# EAGLE design main (EAGLE 6.6.0)
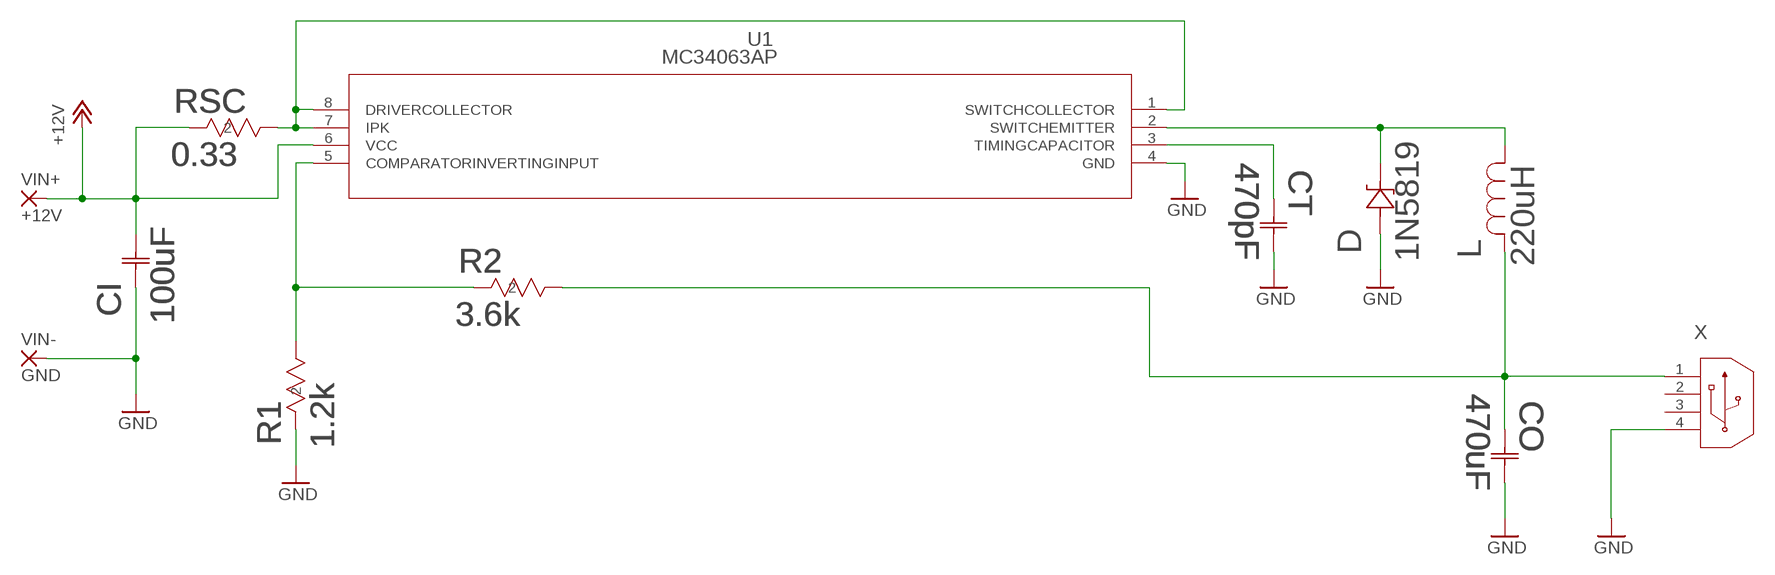
[diagram p0: schematic, sheet 1]

## Parts
CI  100uF  UVR1V101MED1TD  [U1-I_NCH]
CO  470uF  UVR1V101MED1TD  [U1-I_NCH]
CT  470pF  FA28C0G1H471JNU06  [CAP_FA28_TDK]
D  1N5819  [DO-41_STM]
L  220uH  6000-221K-RC  [IND_6000]
R1  1.2k  MRS16000C1201FCT00  [RES_MRS16_VIS]
R2  3.6k  RNMF14FTC3K60  [STA_RNMF14_STP]
RSC  0.33  PF1262-0R33F1  [PF1262-0R33F1]
U1  MC34063AP  [P8]
VIN+  +12V  2,54/1,1  [2,54/1,1]
VIN-  GND  2,54/1,1  [2,54/1,1]
X  6364372-2  [CONN_6364372-2_TEC]

## Nets
+12V: CI.2 RSC.2 U1.6(VCC) VIN+.1(P)
GND: CI.1 CO.2 CT.2 D.2 R1.2 U1.4(GND) VIN-.1(P) X.4
N$1: CT.1 U1.3(TIMINGCAPACITOR)
N$2: D.1 L.1 U1.2(SWITCHEMITTER)
N$3: CO.1 L.2 R2.1 X.1
N$4: RSC.1 U1.1(SWITCHCOLLECTOR) U1.7(IPK) U1.8(DRIVERCOLLECTOR)
N$5: R1.1 R2.2 U1.5(COMPARATORINVERTINGINPUT)
Unconnected: X.2 X.3

## Library data of the parts
CI CO = USB_Car_Charger_Parts:UVR1V101MED1TD; BUILT_BY: EMA_UL_Team; MANUFACTURER_PART_NUMBER: UVR1V101MED1TD; SOURCELIBRARY: Nichicon_2014-12-31; VENDOR: Nichicon
CT = USB_Car_Charger_Parts:FA28C0G1H471JNU06; BUILT_BY: EMA_Matt; COPYRIGHT: Copyright (C) 2018 Accelerated Designs. All rights reserved; MANUFACTURER_PART_NUMBER: FA28C0G1H471JNU06; SOURCELIBRARY: TDK_2019-10-09; VENDOR: TDK
D = USB_Car_Charger_Parts:1N5819; BUILT_BY: EMA_UL_Team; MANUFACTURER_PART_NUMBER: 1N5819; SOURCELIBRARY: StMicro_2011-06-07; VENDOR: STMicroelectronics
L = USB_Car_Charger_Parts:6000-221K-RC; BUILT_BY: EMA_UL_Team; MANUFACTURER_PART_NUMBER: 6000-221K-RC; SOURCELIBRARY: Bourns_2010-01-01_IND_6000; VENDOR: Bourns Electronics
R1 = USB_Car_Charger_Parts:MRS16000C1201FCT00; BUILT_BY: EMA_UL_Team; MANUFACTURER_PART_NUMBER: MRS16000C1201FCT00; SOURCELIBRARY: Vishay_2020-02-10; VENDOR: Vishay
R2 = USB_Car_Charger_Parts:RNMF14FTC3K60; BUILT_BY: EMA_UL_Team; MANUFACTURER_PART_NUMBER: RNMF14FTC3K60; SOURCELIBRARY: Stackpole_2014-12-31; VENDOR: Stackpole International
RSC = USB_Car_Charger_Parts:PF1262-0R33F1
U1 = USB_Car_Charger_Parts:MC34063AP; DATASHEET_URL: http://www.ti.com/lit/gpn/MC34063A; DESCRIPTION: 1.5-A Boost/Buck/Inverting Switching Regulator; FAMILY_NAME: INVERTING REGULATOR; GENERIC_PART_NUMBER: MC34063A; INDUSTRY_STD_PKG_TYPE: PDIP; MANUFACTURER: Texas Instruments; PACKAGE_DESIGNATOR: P; PIN_COUNT: 8
VIN+ VIN- = wirepad:2,54/1,1: THROUGH-HOLE PAD
X = USB_Car_Charger_Parts:6364372-2; BUILT_BY: EMA_Justin; COPYRIGHT: Copyright (C) 2018 Accelerated Designs. All rights reserved; MANUFACTURER_PART_NUMBER: 6364372-2; SOURCELIBRARY: TE_Connectivity_2019-11-07; VENDOR: TE Connectivity

## Board
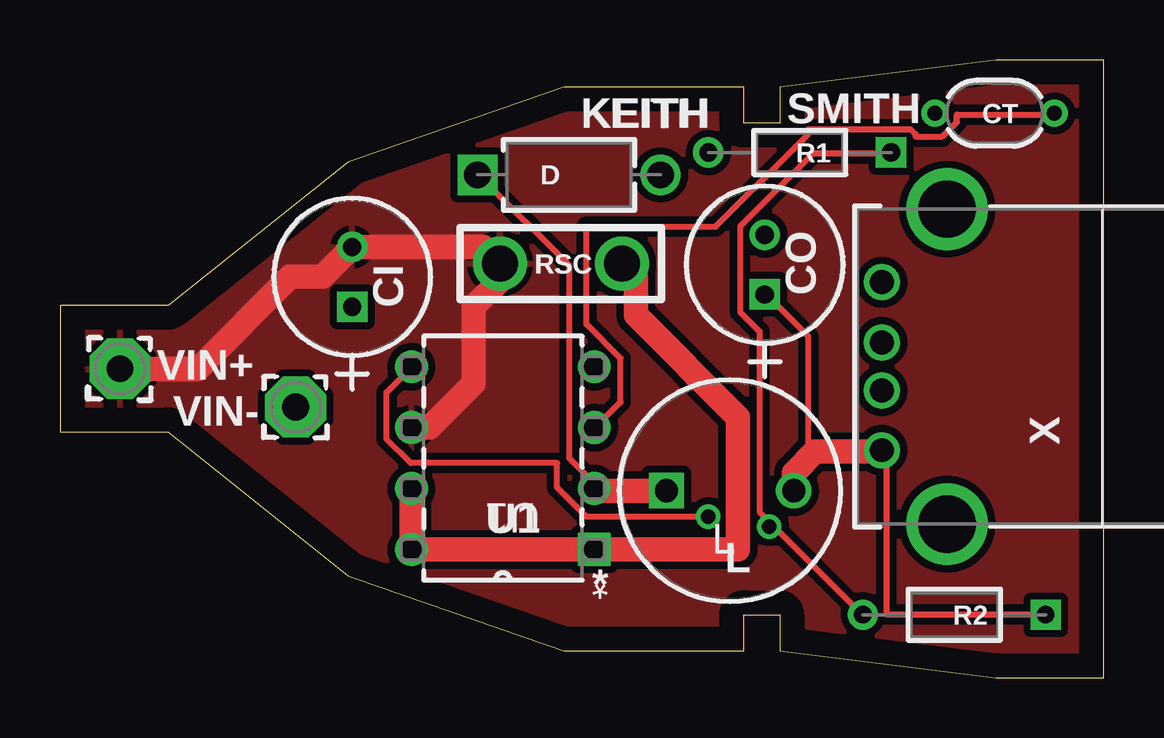
[diagram p1: board, top side]
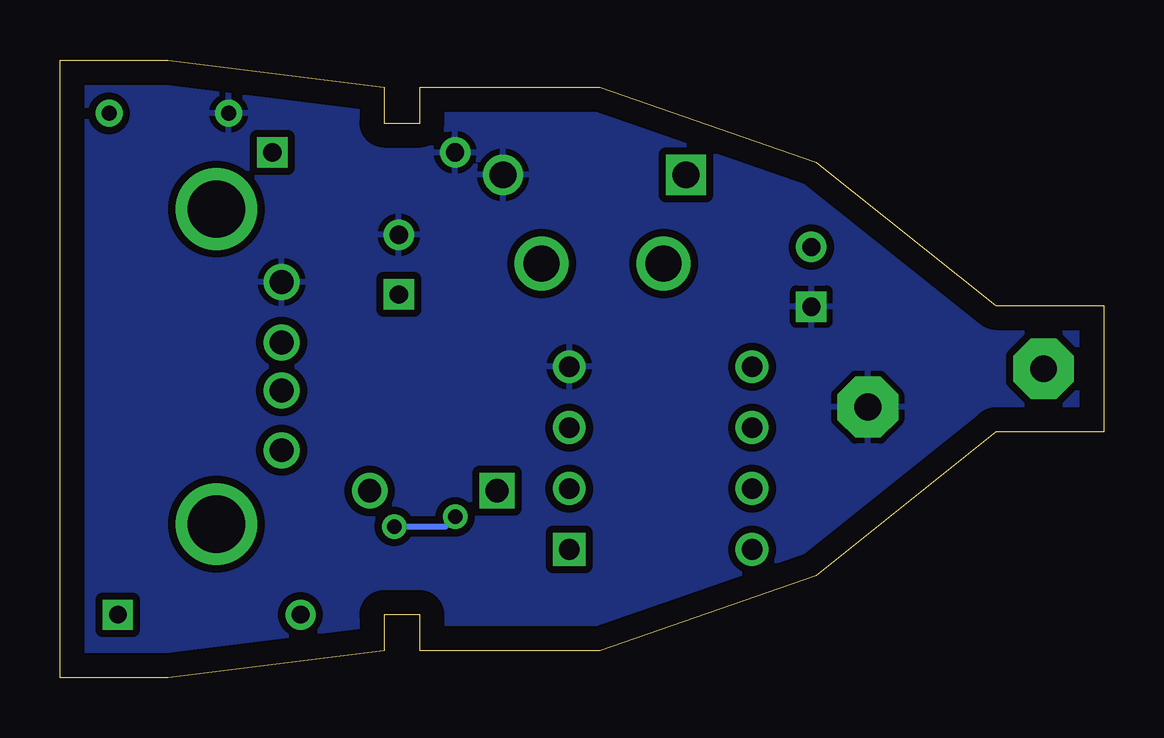
[diagram p2: board, bottom side, seen from below]

Size 43.5 x 25.75 mm. Coordinates in mm from the lower left corner, seen from the top.
Outline: 4.5,10.25 12,4.25 21,1.12 28.5,1.12 28.5,2.62 30,2.62 30,1.12 39,0 43.5,0 43.5,25.75 39,25.75 30,24.62 30,23.12 28.5,23.12 28.5,24.62 21,24.62 12,21.5 4.5,15.52 0,15.52 0,10.25 4.5,10.25
Copper layers (1*16): Top 0.035mm / dielectric 1.5mm / Bottom 0.035mm
Design rules "default": minimum track width 10mil, minimum drill 24mil, track to track 8mil, track to pad 8mil, pad to pad 8mil, via to via 8mil, smd to smd 8mil, copper to edge 40mil, drill to drill 8mil, minimum pad ring 10mil, minimum via ring 8mil, stop-mask expansion 4mil, vias tented up to drill 0mil, thermal gap 10mil

### Footprints (pad centres in the part's own frame; a part is rotated, then mirrored left to right if it is on the bottom)
U1-I_NCH = drill 0.762 pad 1.27 square: 1 0,0 | drill 0.762 pad 1.27: 2 2.489,0
CAP_FA28_TDK = drill 0.61 pad 1.118: 1 -2.489,0; 2 2.489,0
DO-41_STM = drill 1.118 pad 1.626 square: 1 0,0 | drill 1.118 pad 1.626: 2 7.62,0
IND_6000 = drill 0.965 pad 1.473 square: 1 0,0 | drill 0.965 pad 1.473: 2 5.309,0
RES_MRS16_VIS = drill 0.762 pad 1.27 square: 1 0,0 | drill 0.762 pad 1.27: 2 7.62,0
STA_RNMF14_STP = drill 0.737 pad 1.245 square: 1 0,0 | drill 0.737 pad 1.245: 2 7.62,0
PF1262-0R33F1 = drill 1.5: 1 -2.54,0; 2 2.54,0
P8 = drill 0.864 pad 1.372 square: 1 -7.62,7.62 | drill 0.864 pad 1.372: 2 -7.62,5.08; 3 -7.62,2.54; 4 -7.62,0; 5 0,0; 6 0,2.54; 7 0,5.08; 8 0,7.62
2,54/1,1 = drill 1.118 pad 2.54 octagon: 1 0,0
CONN_6364372-2_TEC = drill 0.991 pad 1.499: 1 0,0; 2 2.489,0; 3 4.496,0; 4 7.01,0 | drill 2.388 pad 2.896: 5 -3.073,-2.718; 6 10.058,-2.718

### Placement (x,y rotation side)
CI  12.18,15.46 90 top
CO  29.38,15.97 90 top
CT  38.96,23.53 180 top
D  17.41,20.96 0 top
L  25.28,7.79 0 top
R1  34.65,21.89 180 top
R2  41.09,2.62 180 top
RSC  20.88,17.26 180 top
U1  14.65,12.96 180 top
VIN+  2.5,12.88 0 top
VIN-  9.82,11.28 180 top
X  34.26,9.47 90 top

### Tracks (layer width: path | path; a pad name or v marks a point on that pad's centre or on a via)
+12V
  Top 1.016: U1.6 15.4,10.42 17.25,12.27 17.25,15.47 18.34,16.56 RSC.2 17.65,17.95 CI.2 10.94,16.71 9.6,16.71 5.76,12.88 VIN+.1
  pour Top (isolate 0.305): 0,15.47 4.45,15.47 12.09,21.51 20.98,24.54 28.45,24.54 28.45,23.11 30.05,23.11 30.05,24.71 39.12,25.78 43.56,25.78 43.56,15.47 43.56,8.89 43.56,2.84 43.56,0 38.94,0 30.05,1.07 30.05,2.67 28.45,2.67 28.45,1.07 20.98,1.07 12.09,4.27 4.45,10.31 0,10.31
GND
  Bottom 0.254: 22.35,12.39 U1.4
  pour Bottom (isolate 0.305): 0,15.47 4.45,15.47 12.09,21.51 21.16,24.71 28.45,24.71 28.45,23.11 30.05,23.11 30.05,24.71 38.94,25.78 43.56,25.78 43.56,18.49 43.56,13.87 43.56,9.78 43.56,5.87 43.56,2.84 43.56,0 38.94,0 30.05,1.07 30.05,2.67 28.45,2.67 28.45,1.07 20.98,1.07 11.91,4.27 4.45,10.31 0,10.31
N$1
  Top 0.254: CT.1 41.35,23.47 37.39,23.47 37.39,23.16 36.78,22.55 35.66,22.55 35.66,22.66 35.46,22.86 31.19,22.86 31.19,22.66 27.33,18.8 21.95,18.8 21.95,14.73 23.37,13.31 23.37,11.48 22.35,10.46 U1.3
N$2
  Top 0.254: D.1 17.48,20.93 21.23,17.17 21.23,9.14 22.05,8.33 U1.2
  Top 1.016: L.1 22.36,7.79 U1.2
N$3
  Top 0.254: R2.1 41.05,2.64 34.44,2.64 34.44,8.94 X.1 | CO.1 29.46,15.95 31.19,14.22 31.19,9.86 31.47,9.42
  Top 1.016: L.2 30.59,8.54 31.47,9.42 34.21,9.42 X.1
N$4
  Top 1.016: U1.7 U1.8 U1.1 28.27,5.33 28.27,10.85 24,15.11 24,16.68 RSC.1
N$5  (via drill 0.61)
  Top 0.254: 29.62,6.45 29.16,6.91 29.16,14.43 28.35,15.24 28.35,18.8 31.39,21.84 34.65,21.84 R1.1 | 29.62,6.45 33.43,2.64 R2.2 | v27.03,6.71 21.95,6.71 20.73,7.92 20.73,8.94 14.63,8.94 13.61,9.96 13.61,11.89 14.63,12.9 U1.5 | v29.57,6.3 29.57,6.4 29.62,6.45
  Bottom 0.254: v27.03,6.71 27.43,6.3 v29.57,6.3

### Text on the board
tPlace: KEITH | SMITH
tDocu: KEITH | SMITH
_tsilk: CT | KEITH | SMITH | R1 | D | RSC | CO | CI | +12V | VIN+ | VIN- | GND | X | U1 | * | L | R2